# EAGLE schematic simplePDwithBatteryv1 (EAGLE 7.5.0)
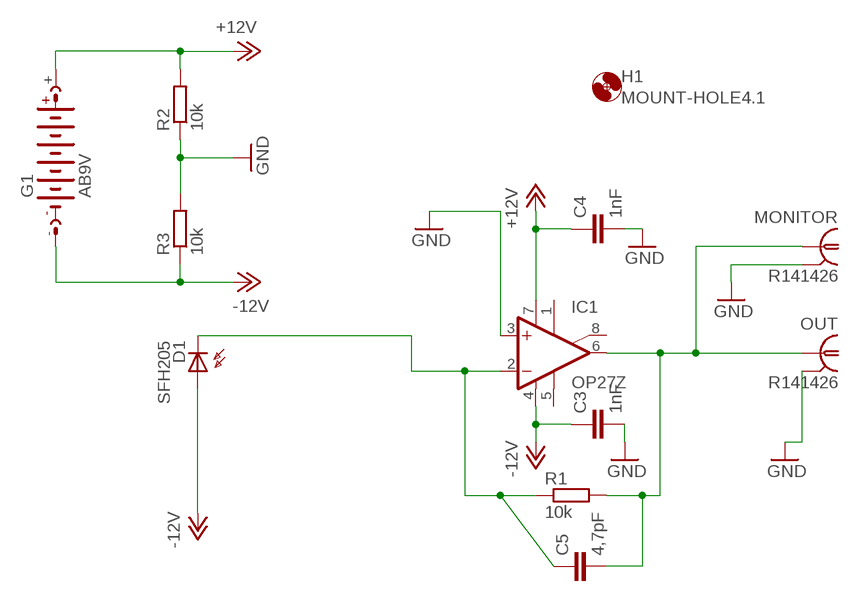
[diagram p0: schematic, sheet 1]

## Parts
C3  1nF  C-EU025-050X050  [C025-050X050]
C4  1nF  C-EU025-050X050  [C025-050X050]
C5  4,7pF  C-EU025-050X050  [C025-050X050]
D1  SFH205  [SFH205]
G1  AB9V  [AB9V]
H1  MOUNT-HOLE4.1  [4,1]
IC1  OP27Z  [DIL08]
MONITOR  R141426  [R141426]
OUT  R141426  [R141426]
R1  10k  R-EU_0207/5V  [0207/5V]
R2  10k  R-EU_0204/5  [0204/5]
R3  10k  R-EU_0204/5  [0204/5]

## Nets
GND: C3.2 C4.2 IC1.3(+IN) MONITOR.2 MONITOR.3 MONITOR.4 MONITOR.5 OUT.2 OUT.3 OUT.4 OUT.5 R2.1 R3.2
N$1: C5.1 D1.K(C) IC1.2(-IN) R1.1
N$2: C5.2 IC1.6(OUT) MONITOR.1 OUT.1 R1.2
V+: C4.1 G1.+ IC1.7(V+) R2.2 ; supply symbol labelled +12V
V-: C3.1 D1.A G1.- IC1.4(V-) R3.1 ; supply symbol labelled -12V
Unconnected: IC1.1(ON1) IC1.5(OPT) IC1.8(ON2)

## Library data of the parts
C3-C5 = resistor:C-EU: CAPACITOR, European symbol
D1 = opto-trans-siemens:SFH205: PHOTO DIODE; OC_FARNELL: unknown; OC_NEWARK: unknown
G1 = battery:AB9V: 9-V BATTERY CLIP
H1 = holes:MOUNT-HOLE: MOUNTING HOLE with drill center marker
IC1 = linear:OP27: OP AMP
MONITOR OUT = con-coax:R141426: BNC COAX CONNECTOR Radiall 50/75 Ohm Spoerle; MF: FARNELL; MPN: R141426161; OC_FARNELL: 4195115; OC_NEWARK: 14J7919
R1-R3 = resistor:R-EU_: RESISTOR, European symbol